# EAGLE design Fonte (EAGLE 9.5.0)
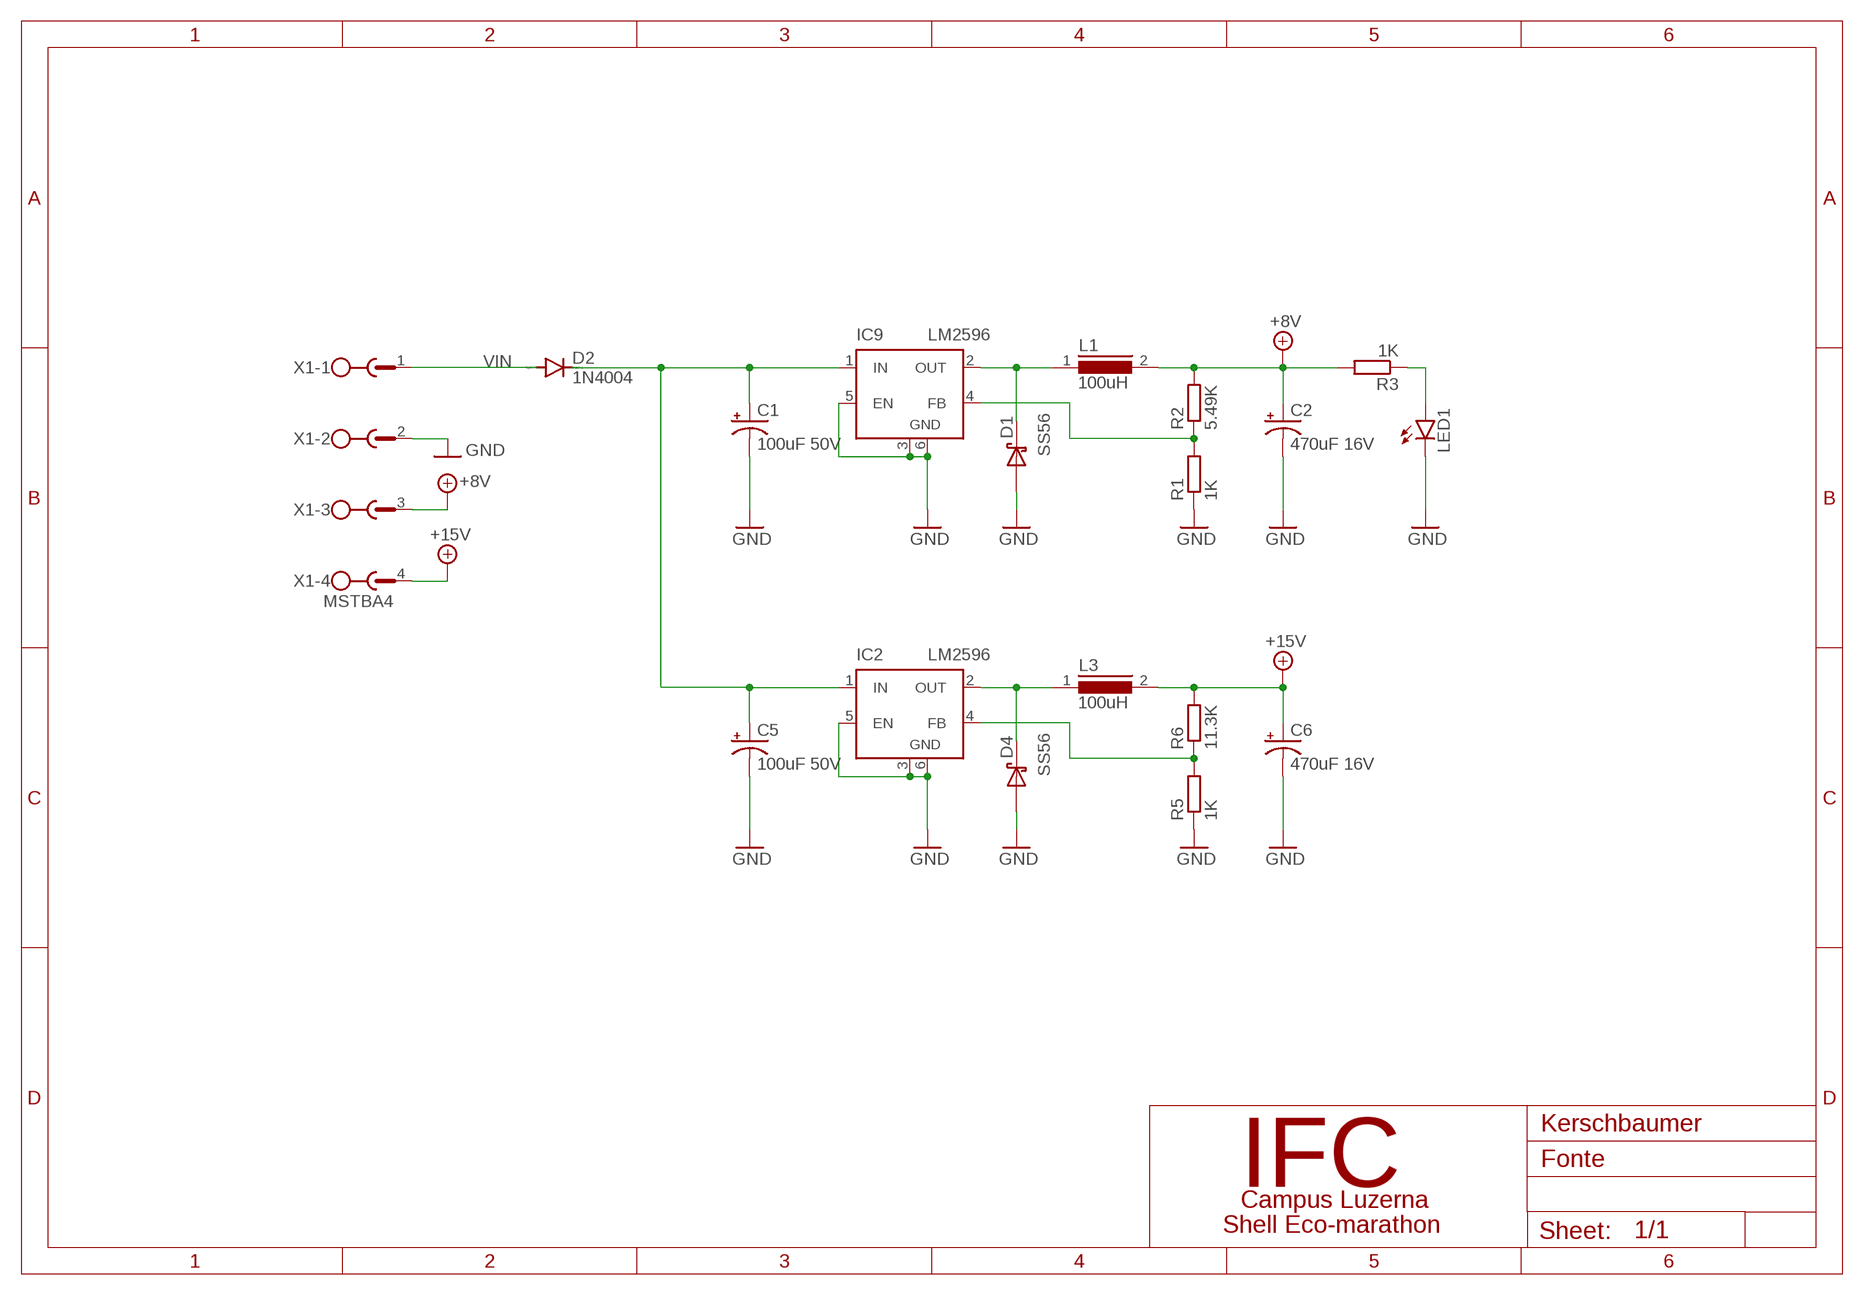
[diagram p0: schematic, sheet 1]

## Parts
C1  100uF 50V  CPOL-USE2.5-7  [E2,5-7]
C2  470uF 16V  CPOL-USE2.5-7  [E2,5-7]
C5  100uF 50V  CPOL-USE2.5-7  [E2,5-7]
C6  470uF 16V  CPOL-USE2.5-7  [E2,5-7]
D1  SS56  DIODE-SCHOTTKY_  [SMA-DIODE]
D2  1N4004  [DO41-10]
D4  SS56  DIODE-SCHOTTKY_  [SMA-DIODE]
IC2  LM2596  LM2596S  [TO263-5]
IC9  LM2596  LM2596S  [TO263-5]
L1  100uH  DR125  [DR125]
L3  100uH  DR125  [DR125]
LED1  LED3MM  [LED3MM]
R1  1K  R-EU_0207/7  [0207/7]
R2  5.49K  R-EU_0207/7  [0207/7]
R3  1K  R-EU_0207/7  [0207/7]
R5  1K  R-EU_0207/7  [0207/7]
R6  11.3K  R-EU_0207/7  [0207/7]
X1  MSTBA4  [MSTBA4]

## Nets
+8V: C2.+ L1.2 R2.2 R3.2 X1.3
+15V: C6.+ L3.2 R6.2 X1.4
GND: C1.- C2.- C5.- C6.- D1.A D4.A IC2.3(GND) IC2.5(EN) IC2.6(GND) IC9.3(GND) IC9.5(EN) IC9.6(GND) LED1.K(C) R1.1 R5.1 X1.2
N$1: C1.+ C5.+ D2.C IC2.1(IN) IC9.1(IN)
N$2: IC9.4(FB) R1.2 R2.1
N$3: D1.C IC9.2(OUT) L1.1
N$4: LED1.A R3.1
N$7: IC2.4(FB) R5.2 R6.1
N$8: D4.C IC2.2(OUT) L3.1
VIN: D2.A X1.1

## Notes on the sheet
- Kerschbaumer
- IFC
- Campus Luzerna
- Shell Eco-marathon

## Library data of the parts
C1 C2 C5 C6 = rcl:CPOL-US: POLARIZED CAPACITOR, American symbol; SPICEPREFIX: C
D1 D4 = ,RK_SteveMarple:DIODE-SCHOTTKY
D2 = diode:1N4004: DIODE general purpose rectifier, 1 A
IC2 IC9 = linear:LM2596S: STEP-DOWN VOLTAGE REGULATOR
L1 L3 = inductors:DR125: High Power Density, High Efficiency, Shielded Inductors Source: coiltronics_dr_series.pdf; SPICEPREFIX: L
LED1 = led:LED: LED OSRAM: - CHIPLED LG R971, LG N971, LY N971, LG Q971, LY Q971, LO R971, LY R971 LH N974, LH R974 LS Q976, LO Q976, LY Q976 LO Q996 - Hyper CHIPLED LW Q18S LB Q993, LB Q99A, LB R99A - SideLED LS A670, LO A670, LY A670, LG A670, LP A670 LB A673, LV A673, LT A673, LW A673 LH A674 LY A675 LS A676, LA A676, LO A676, LY A676, LW A676 LS A679, LY A679, LG A679 - Hyper Micro SIDELED® LS Y876, LA Y876, LO Y876, LY Y876 LT Y87S - SmartLED LW L88C, LW L88S LB L89C, LB L89S, LG L890 LS L89K, LO L89K, LY L89K LS L896, LA L896, LO L896, LY L896 - TOPLED LS T670, LO T670, LY T670, LG T670, LP T670 LSG T670, LSP T670, LSY T670, LOP T670, LYG T670 LG T671, LOG T671, LSG T671 LB T673, LV T673, LT T673, LW T673 LH T674 LS T676, LA T676, LO T676, LY T676, LB T676, LH T676, LSB T676, LW T676 LB T67C, LV T67C, LT T67C, LS T67K, LO T67K, LY T67K, LW E67C LS E67B, LA E67B, LO E67B, LY E67B, LB E67C, LV E67C, LT E67C LW T67C LS T679, LY T679, LG T679 LS T770, LO T770, LY T770, LG T770, LP T770 LB T773, LV T773, LT T773, LW T773 LH T774 LS E675, LA E675, LY E675, LS T675 LS T776, LA T776, LO T776, LY T776, LB T776 LHGB T686 LT T68C, LB T68C - Hyper Mini TOPLED® LB M676 - Mini TOPLED Santana® LG M470 LS M47K, LO M47K, LY M47K Source: http://www.osram.convergy.de LUXEON: - LUMILED® LXK2-PW12-R00, LXK2-PW12-S00, LXK2-PW14-U00, LXK2-PW14-V00 LXK2-PM12-R00, LXK2-PM12-S00, LXK2-PM14-U00 LXK2-PE12-Q00, LXK2-PE12-R00, LXK2-PE12-S00, LXK2-PE14-T00, LXK2-PE14-U00 LXK2-PB12-K00, LXK2-PB12-L00, LXK2-PB12-M00, LXK2-PB14-N00, LXK2-PB14-P00, LXK2-PB14-Q00 LXK2-PR12-L00, LXK2-PR12-M00, LXK2-PR14-Q00, LXK2-PR14-R00 LXK2-PD12-Q00, LXK2-PD12-R00, LXK2-PD12-S00 LXK2-PH12-R00, LXK2-PH12-S00 LXK2-PL12-P00, LXK2-PL12-Q00, LXK2-PL12-R00 Source: www.luxeon.com KINGBRIGHT: KA-3528ASYC Source: www.kingbright.com
R1-R3 R5 R6 = rcl:R-EU_: RESISTOR, European symbol; SPICEPREFIX: R
X1 = con-phoenix-508:MSTBA4: PHOENIX; MF: FARNELL; MPN: 1757268; OC_FARNELL: 3705195; OC_NEWARK: 71C4163

## Board
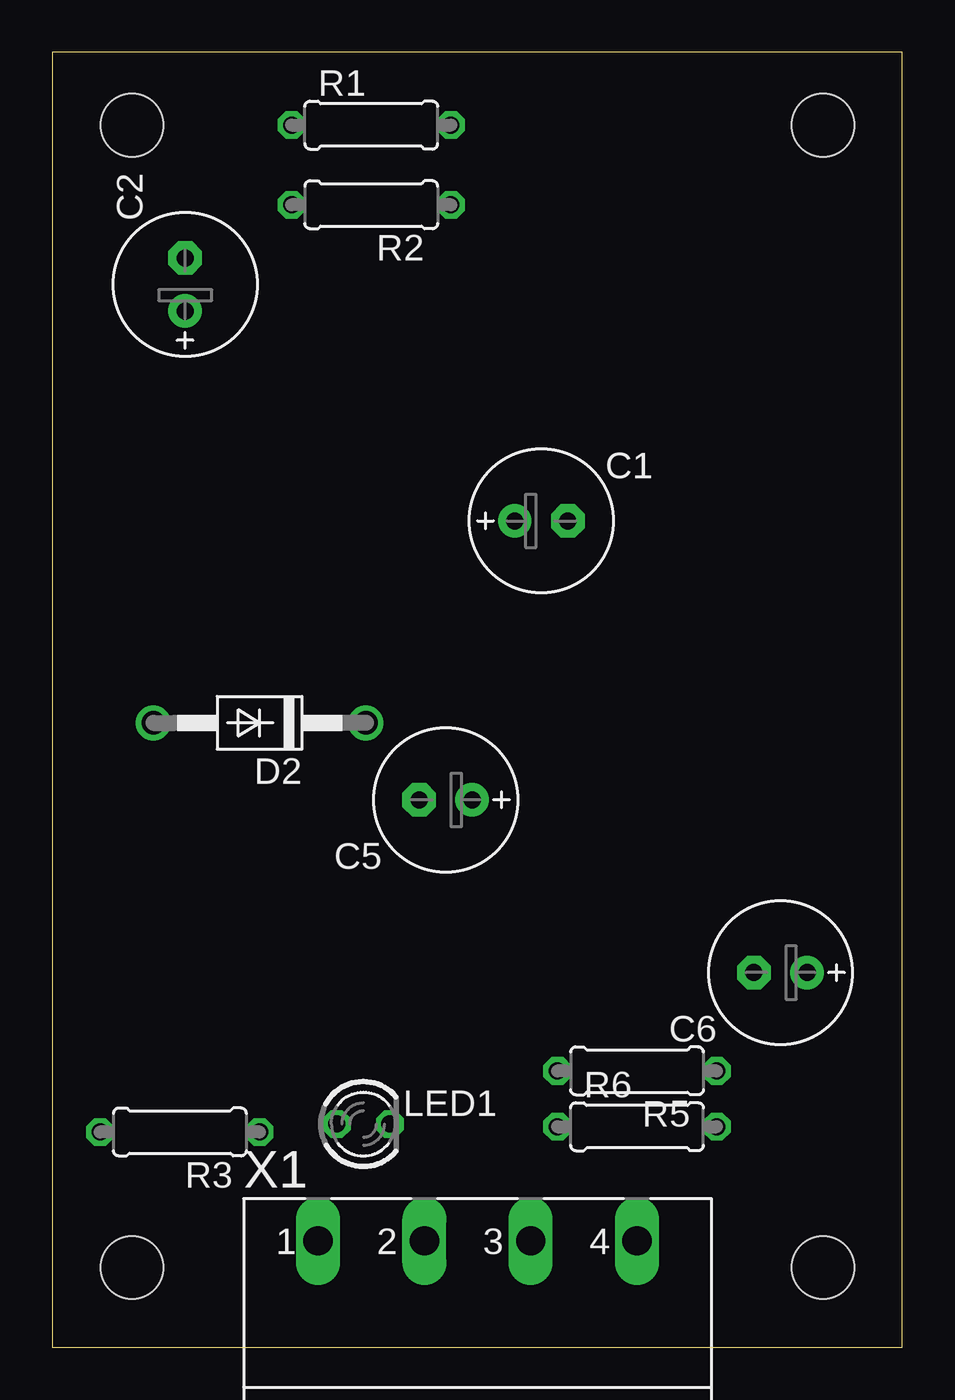
[diagram p1: board, top side]
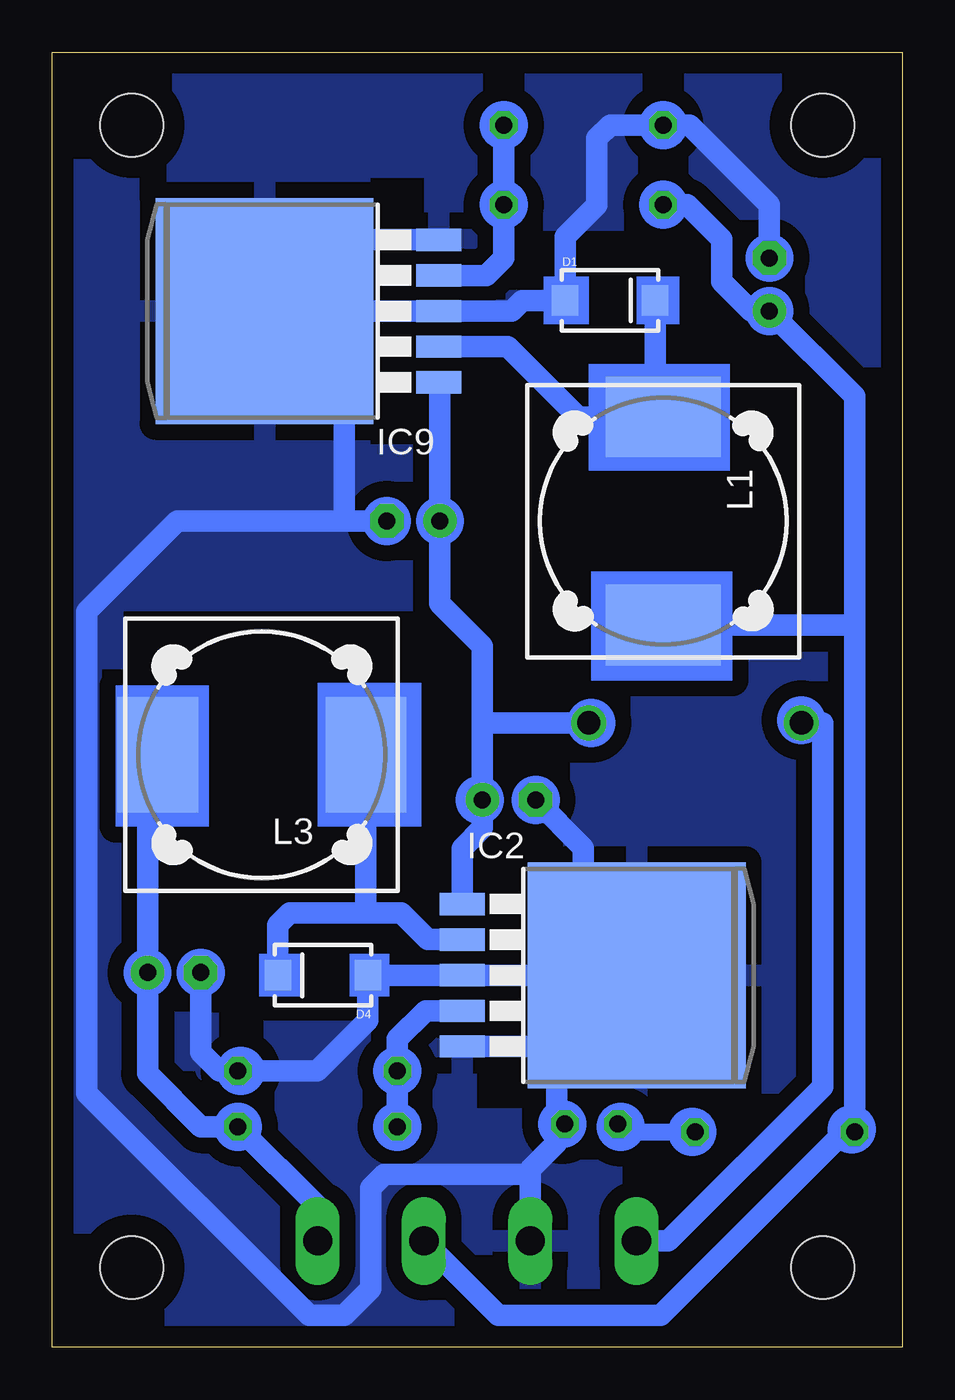
[diagram p2: board, bottom side, seen from below]

Size 40.62 x 61.9 mm. Coordinates in mm from the lower left corner, seen from the top.
Outline: 0,0 40.62,0 40.62,61.9 0,61.9 0,0
Copper layers (1*16): Top 0.035mm / dielectric 1.5mm / Bottom 0.035mm
Design rules "default *": minimum track width 6mil, minimum drill 0.35mm, track to track 30mil, track to pad 30mil, pad to pad 20mil, via to via 20mil, smd to smd 20mil, copper to edge 40mil, drill to drill 6mil, minimum pad ring 10mil, minimum via ring 8mil, stop-mask expansion 4mil, vias tented up to drill 0mil, thermal gap 30mil
Holes 3 mm at 3.81,58.42 36.83,58.42 3.81,3.81 36.83,3.81
bRestrict: area 24.4,16.5 to 31.1,19.3; area 10.5,48.5 to 17.4,51.6; area 7.6,41.7 to 15.4,47.8; area 7.5,31.8 to 15.1,37.5; area 22.6,24.3 to 28.6,32.6; area 32.1,24.6 to 38.2,32.4; area 4.8,33 to 18,46; area 24,21.6 to 37.2,35.2; area 17.8,11.4 to 20.3,22.9; area 22.9,43.2 to 25.4,55.9; area 25.4,15.6 to 32.6,16.5; area 11.4,51.3 to 15.7,53.3; 3 more areas

### Footprints (pad centres in the part's own frame; a part is rotated, then mirrored left to right if it is on the bottom)
E2,5-7 = drill 0.813 pad 1.6: + -1.27,0 | drill 0.813 pad 1.6 octagon: - 1.27,0
SMA-DIODE = smd 1.27 x 1.47: A -2.15,0; C 2.15,0
DO41-10 = drill 1.118: A 5.08,0; C -5.08,0
TO263-5 = smd 1.067 x 2.159: 1 -3.404,-5.791; 2 -1.702,-5.791; 3 0,-5.791; 4 1.702,-5.791; 5 3.404,-5.791 | smd 10.8 x 10.41: 6 0,2.54
DR125 = smd 3.85 x 5.5: 1 -4.975,0; 2 4.975,0
LED3MM = drill 0.813 octagon: A -1.27,0; K 1.27,0
0207/7 = drill 0.813 octagon: 1 -3.81,0; 2 3.81,0
MSTBA4 = drill 1.397 long: 1 -7.62,5.08; 2 -2.54,5.08; 3 2.54,5.08; 4 7.62,5.08

### Placement (x,y rotation side)
C1  23.37,39.5 0 top
C2  6.35,50.8 90 top
C5  18.8,26.16 180 top
C6  34.8,17.91 180 top
D1  13.97,50.04 0 bottom
D2  9.91,29.84 180 top
D4  27.69,17.78 180 bottom
IC2  15.24,17.78 270 bottom
IC9  27.94,49.53 90 bottom
L1  11.43,39.5 270 bottom
L3  30.61,28.32 180 bottom
LED1  14.86,10.67 0 top
R1  15.24,58.42 0 top
R2  15.24,54.61 180 top
R3  6.1,10.29 180 top
R5  27.94,13.21 180 top
R6  27.94,10.54 0 top
X1  20.32,0 0 top

### Tracks (layer width: path | path; a pad name or v marks a point on that pad's centre or on a via)
+8V
  Bottom 0.813: R3.2 2.54,10.54
  Bottom 1.016: L1.2 2.29,34.52 | X1.3 19.3,1.52 11.56,1.52 2.54,10.54 2.29,10.79 2.29,34.52 | 2.29,34.52 2.29,45.47 C2.+ 7.22,49.53 8.64,50.94 8.64,52.96 10.29,54.61 R2.2
+15V
  Bottom 1.016: L3.2 36.07,27.84 C6.+ 36.07,13.08 33.53,10.54 R6.2 27.94,6.73 X1.4
GND
  Bottom 0.813: LED1.K 16.13,10.16 16.51,9.78
  Bottom 1.016: IC9.5 25.81,52.93 29.21,49.53 | 29.21,49.53 26.67,49.53 | 26.67,49.53 IC9.3 18.66,49.53 18.15,50.04 D1.A 16.12,53.09 14.61,54.6 14.61,57.78 13.97,58.42 R1.1 10.16,58.42 6.35,54.61 C2.- | 26.67,49.53 26.67,39.5 C1.- 34.65,39.5 38.97,35.18 38.97,12.14 28.35,1.52 26.67,1.52 25.4,2.79 25.4,7.62 24.77,8.26 17.78,8.26 | 15.24,17.78 15.24,23.88 C5.- | 15.24,17.78 15.24,14.99 | 15.24,14.99 15.24,13.97 15.75,13.97 | IC2.5 16.51,14.38 | 16.51,14.38 15.85,14.38 15.24,14.99 | 16.51,17.78 IC2.3 D4.A 25.54,15.62 27.95,13.21 R5.1 32.64,13.21 33.53,14.1 C6.- | 16.51,17.78 15.24,17.78 | 16.51,14.38 16.51,9.78 17.78,8.51 17.78,8.26 | X1.2 17.78,8.26 | IC2.6 13.97,16.51 13.97,15.24 16.51,15.24 16.51,17.78 | IC9.6 30.48,48.26 29.21,46.99 29.21,49.53
  pour Bottom: 1.27,1.27 39.37,1.27 39.37,60.96 1.27,60.96
N$1
  Bottom 1.016: IC2.1 21.03,23.85 20.07,24.82 C5.+ 20.07,29.84 | IC9.1 22.1,46.08 C1.+ 22.1,35.56 20.07,33.53 20.07,29.84 | 20.07,29.84 D2.C
N$2
  Bottom 1.016: R1.2 R2.1 19.05,52.07 19.89,51.23 IC9.4
N$3
  Bottom 1.016: D1.C 11.82,44.35 11.94,44.47 | 10.8,45.1 L1.1 11.94,44.47 | IC9.2 18.85,47.83 15.49,44.47 11.94,44.47
N$4
  Bottom 0.813: LED1.A 13.21,10.29 R3.1
N$7
  Bottom 1.016: IC2.4 22.78,16.08 24.13,14.73 R6.1 R5.2
N$8
  Bottom 1.016: 25.63,20.75 23.95,20.75 22.68,19.48 IC2.2 | 25.63,20.75 29.28,20.75 29.84,20.19 D4.C | L3.1 25.63,20.75
VIN
  Bottom 1.016: X1.1 11.18,5.08 3.81,12.45 3.81,29.84 D2.A
(copper drawn outside any net)
  shapes: Bottom area x8, Bottom circle x22